# Altium schematic sheet 测量轮_Ver0.1(1).SchDoc
size 342 x 304 mm
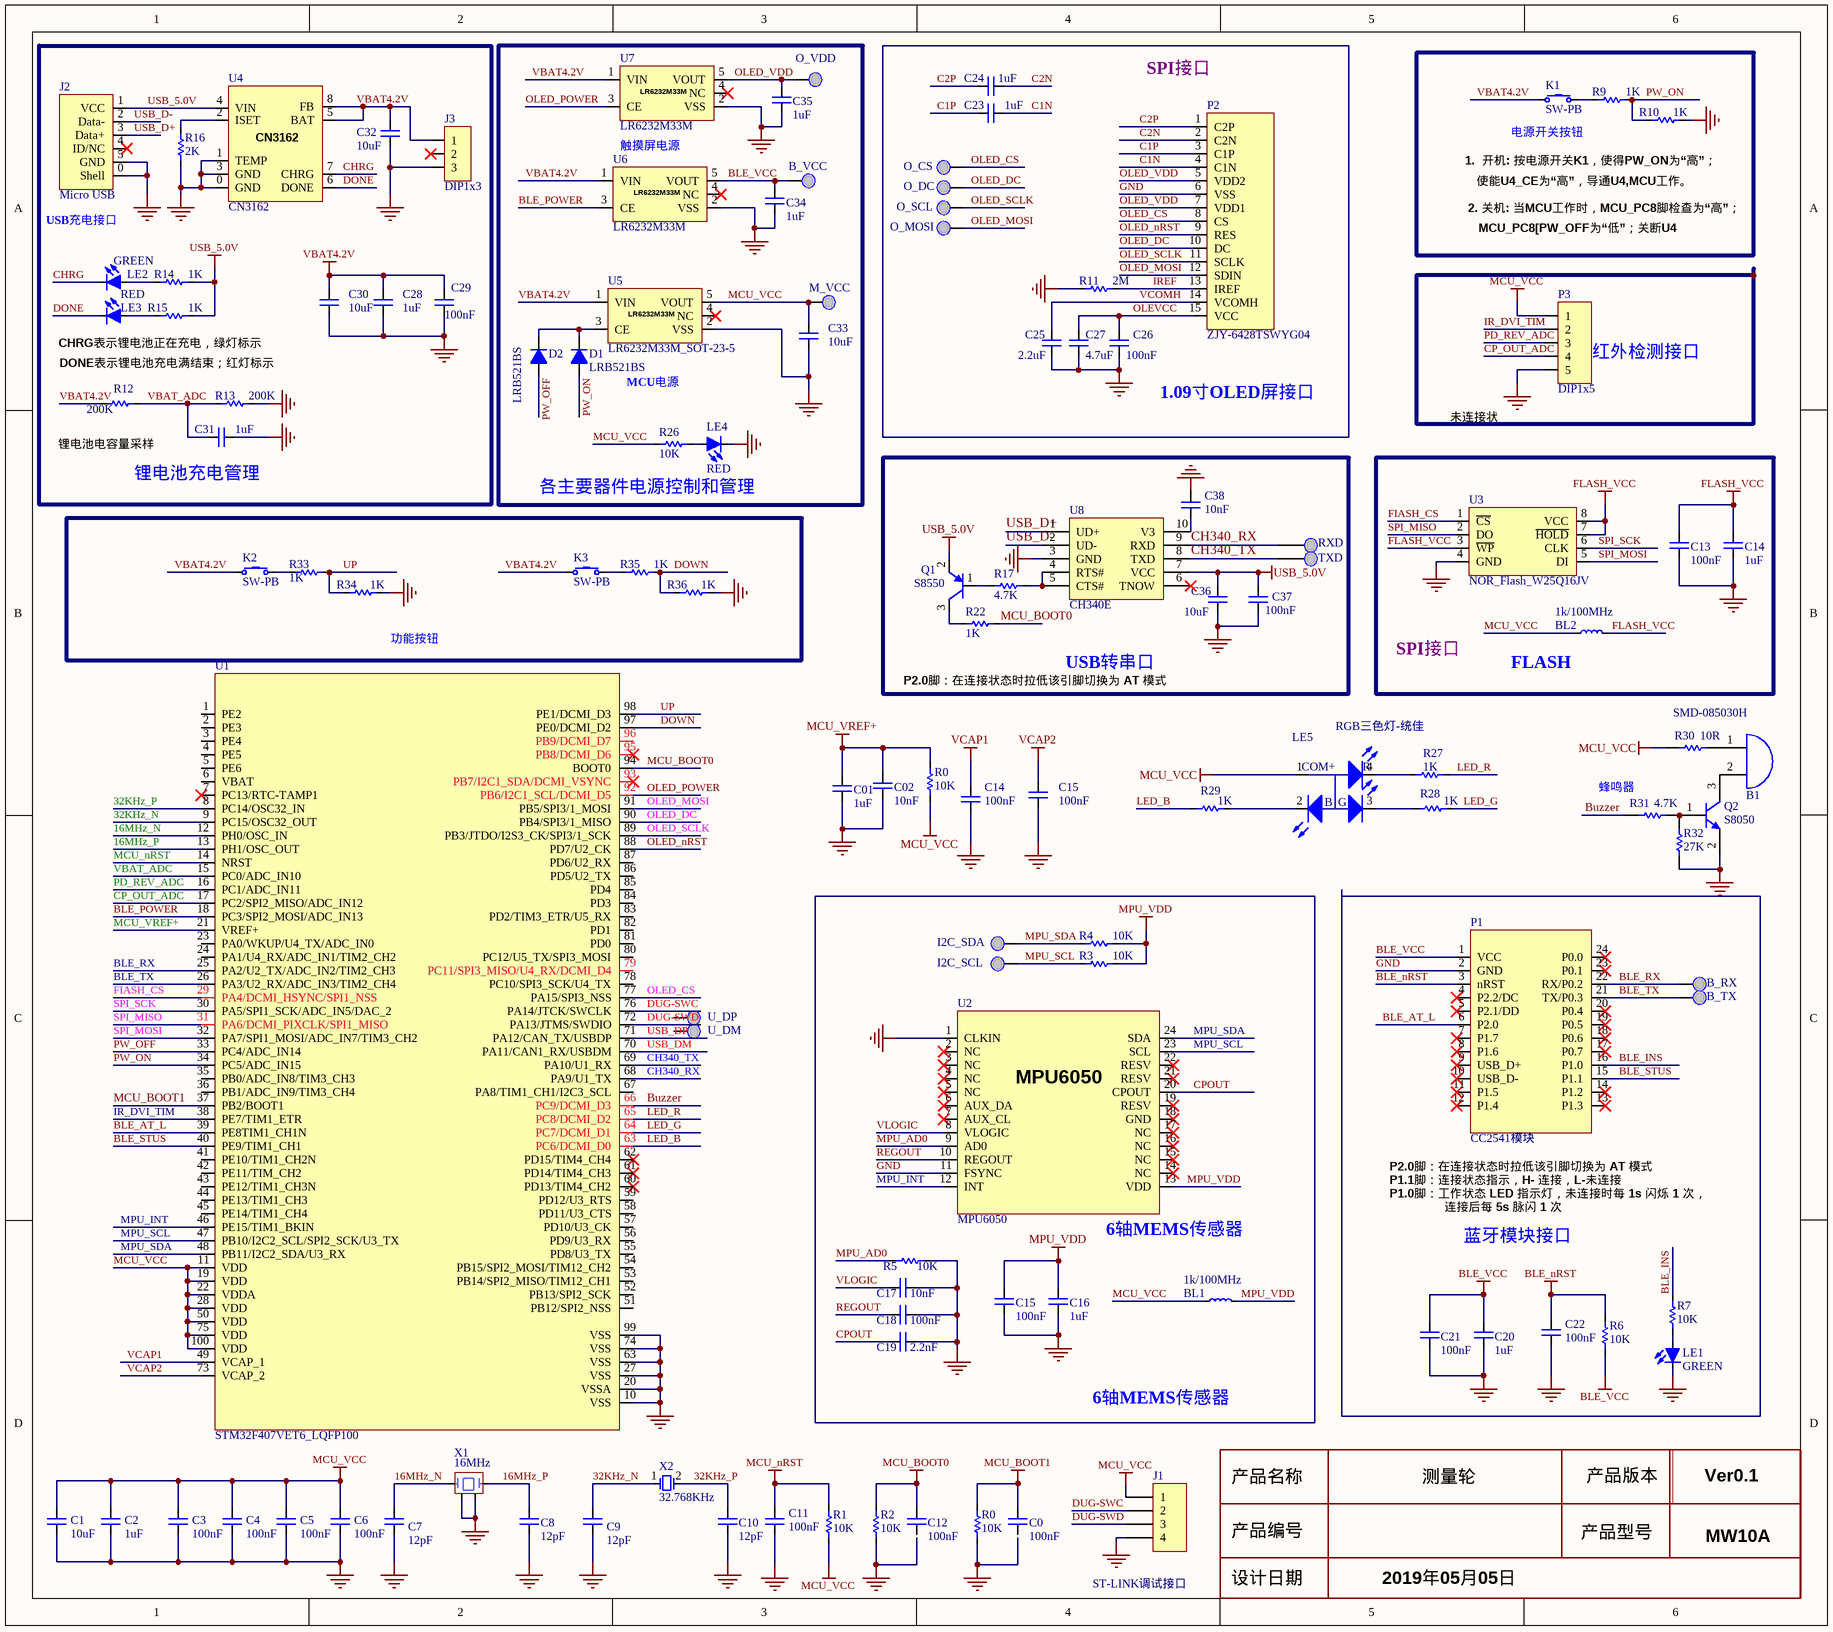
[diagram p0: 测量轮_Ver0.1(1).SchDoc]

## Parts
(Parts that share a designator on the sheet are numbered #1, #2 ... from top to bottom, then left to right.)
B1  SMD-085030H  [BEEP_1]
B_RX  TEST_Piont  [Test Piont-40]  (value not drawn)
B_TX  TEST_Piont  [Test Piont-40]  (value not drawn)
B_VCC  TEST_Piont  [Test Piont-40]  (value not drawn)
BL1  1k/100MHz  [BL0402_0.35]
BL2  1k/100MHz  [BL0402_0.35]
C0  100nF  [C0402_0.5mm]
C1  10uF  [C0603_0.8mm]
C01  1uF  [C0402_0.5mm]
C2  1uF  [C0402_0.5mm]
C02  10nF  [C0402_0.5mm]
C3  100nF  [C0402_0.5mm]
C4  100nF  [C0402_0.5mm]
C5  100nF  [C0402_0.5mm]
C6  100nF  [C0402_0.5mm]
C7  12pF  [C0402_0.5mm]
C8  12pF  [C0402_0.5mm]
C9  12pF  [C0402_0.5mm]
C10  12pF  [C0402_0.5mm]
C11  100nF  [C0402_0.5mm]
C12  100nF  [C0402_0.5mm]
C13  100nF  [C0402_0.5mm]
C14#1  1uF  [C0402_0.5mm]
C14#2  100nF  [C0402_0.5mm]
C15#1  100nF  [C0402_0.5mm]
C15#2  100nF  [C0402_0.5mm]
C16  1uF  [C0402_0.5mm]
C17  10nF  [C0402_0.5mm]
C18  100nF  [C0402_0.5mm]
C19  2.2nF  [C0402_0.5mm]
C20  1uF  [C0402_0.5mm]
C21  100nF  [C0402_0.5mm]
C22  100nF  [C0402_0.5mm]
C23  1uF  [C0402_0.5mm]
C24  1uF  [C0402_0.5mm]
C25  2.2uF  [C0402_0.5mm]
C26  100nF  [C0402_0.5mm]
C27  4.7uF  [C0402_0.5mm]
C28  1uF  [C0402_0.5mm]
C29  100nF  [C0402_0.5mm]
C30  10uF  [C0402_0.5mm]
C31  1uF  [C0402_0.5mm]
C32  10uF  [C0402_10uF]
C33  10uF  [C0402_0.5mm]
C34  1uF  [C0402_0.5mm]
C35  1uF  [C0402_0.5mm]
C36  10uF  [C0402_0.5mm]
C37  100nF  [C0402_0.5mm]
C38  10nF  [C0402_0.5mm]
D1  LRB521BS  [DFN1006-LRB521BS]
D2  LRB521BS  [DFN1006-LRB521BS]
I2C_SCL  TEST_Piont  [Test Piont-40]  (value not drawn)
I2C_SDA  TEST_Piont  [Test Piont-40]  (value not drawn)
J1  ST-LINK调试接口  [Scoket1x4_1.27mm]
J2  Micro USB
J3  DIP1x3
K1  SW-PB
K2  SW-PB
K3  SW-PB
LE1  GREEN
LE2  GREEN
LE3  RED
LE4  RED
LE5  RGB三色灯-统佳  [RGB1615-统佳]
M_VCC  TEST_Piont  [Test Piont-40]  (value not drawn)
O_CS  TEST_Piont  [Test Piont-40]  (value not drawn)
O_DC  TEST_Piont  [Test Piont-40]  (value not drawn)
O_MOSI  TEST_Piont  [Test Piont-40]  (value not drawn)
O_SCL  TEST_Piont  [Test Piont-40]  (value not drawn)
O_VDD  TEST_Piont  [Test Piont-40]  (value not drawn)
P1  CC2541模块
P2  ZJY-6428TSWYG04
P3  DIP1x5
Q1  S8550
Q2  S8050  [SOT-23]
R0#1  10K  [R0402_0.35mm]
R0#2  10K  [R0402_0.35mm]
R1  10K  [R0402_0.35mm]
R2  10K  [R0402_0.35mm]
R3  10K  [R0402_0.35mm]
R4  10K  [R0402_0.35mm]
R5  10K  [R0402_0.35mm]
R6  10K  [R0402_0.35mm]
R7  10K  [R0402_0.35mm]
R9  1K  [R0402_0.35mm]
R10  1K  [R0402_0.35mm]
R11  2M  [R0402_0.35mm]
R12  200K  [R0402_0.35mm]
R13  200K  [R0402_0.35mm]
R14  1K  [R0402_0.35mm]
R15  1K  [R0402_0.35mm]
R16  2K
R17  4.7K
R22  1K
R26  10K  [R0402_0.35mm]
R27  1K  [R0402_0.35mm]
R28  1K  [R0402_0.35mm]
R29  1K  [R0402_0.35mm]
R30  10R  [R0402_0.35mm]
R31  4.7K  [R0402_0.35mm]
R32  27K  [R0402_0.35mm]
R33  1K  [R0402_0.35mm]
R34  1K  [R0402_0.35mm]
R35  1K  [R0402_0.35mm]
R36  1K  [R0402_0.35mm]
RXD  TP  [TESTPOINT_1*1mm]  (value not drawn)
TXD  TP  [TESTPOINT_1*1mm]  (value not drawn)
U1  STM32F407VET6_LQFP100
U2  MPU6050
U3  NOR_Flash_W25Q16JV  [SOIC8-150mil_W25Q16JV]
U4  CN3162
U5  LR6232M33M_SOT-23-5  [SOT23-5_LR6232A33M]
U6  LR6232M33M
U7  LR6232M33M
U8  CH340E  [MSOP10]
U_DM  TEST_Piont  [Test Piont-40]  (value not drawn)
U_DP  TEST_Piont  [Test Piont-40]  (value not drawn)
X1  16MHz  [FA-128_16MHz_4P]
X2  32.768KHz

## Nets
BLE_nRST: C22.2 P1.3(nRST) R6.2
BLE_VCC: B_VCC.1(T) C20.2 C21.2 C34.2 P1.1(VCC) R6.1 U6.5(VOUT)
FLASH_VCC: BL2.1 C13.2 C14#1.2 U3.3(~{WP}) U3.7(~{HOLD}) U3.8(VCC)
GND: C1.1 C01.1 C2.1 C02.1 C3.1 C4.1 C5.1 C6.1 C7.1 C8.1 C9.1 C10.1 C11.1 C13.1 C14#1.1 C14#2.1 C15#1.1 C15#2.1 C16.1 C17.2 C18.2 C19.2 C20.1 C21.1 C22.1 C25.1 C26.1 C27.1 C28.2 C29.2 C30.2 C31.2 C32.1 C33.2 C34.1 C35.1 C36.1 C37.1 C38.2 J1.4 J2.0(Shell) J2.5(GND) J3.3 LE1.2(K) LE4.2(K) P1.2(GND) P2.6(VSS) P3.5 Q2.2(E) R0#2.1 R2.1 R5.2 R10.2 R11.2 R13.2 R16.1 R32.1 R34.2 R36.2 U1.10(VSS) U1.20(VSSA) U1.27(VSS) U1.63(VSS) U1.74(VSS) U1.99(VSS) U2.1(CLKIN) U2.11(FSYNC) U3.4(GND) U4.0(GND) U4.1(TEMP) U4.3(GND) U5.2(VSS) U6.2(VSS) U7.2(VSS) U8.3(GND) X1.2 X1.4
MCU_BOOT0: C12.2 R2.2 R22.2 U1.94(BOOT0)
MCU_BOOT1: C0.2 R0#2.2 U1.37(PB2/BOOT1)
MCU_nRST: C11.2 R1.2 U1.14(NRST)
MCU_VCC: BL1.2 BL2.2 C1.2 C2.2 C3.2 C4.2 C5.2 C6.2 C33.1 J1.1 LE5.1(COM) M_VCC.1(T) P3.1 R0#1.1 R1.1 R26.2 R30.2 U1.11(VDD) U1.19(VDD) U1.22(VDDA) U1.28(VDD) U1.50(VDD) U1.75(VDD) U1.100(VDD) U5.5(VOUT)
MCU_VREF+: C01.2 C02.2 R0#1.2 U1.21(VREF+)
MPU_VDD: BL1.1 C15#2.2 C16.2 R3.1 R4.1 U2.13(VDD)
USB_5.0V: C36.2 C37.2 J2.1(VCC) Q1.2(E) R14.1 R15.1 U4.4(VIN) U8.7(VCC)
VBAT4.2V: C28.1 C29.1 C30.1 C32.2 J3.1 K1.1 K2.1 K3.1 R12.1 U4.5(BAT) U4.8(FB) U5.1(VIN) U6.1(VIN) U7.1(VIN)
VCAP1: C14#2.2 U1.49(VCAP_1)
VCAP2: C15#1.2 U1.73(VCAP_2)
16MHz_N: C7.2 U1.12(PH0/OSC_IN) X1.3
16MHz_P: C8.2 U1.13(PH1/OSC_OUT) X1.1
32KHz_N: C9.2 U1.9(PC15/OSC32_OUT) X2.1
32KHz_P: C10.2 U1.8(PC14/OSC32_IN) X2.2
BLE_AT_L: P1.6(P2.0) U1.39(PE8TIM1_CH1N)
BLE_INS: P1.16(P1.0) R7.2
BLE_POWER: U1.18(PC3/SPI2_MOSI/ADC_IN13) U6.3(CE)
BLE_RX: B_RX.1(T) P1.22(RX/P0.2) U1.25(PA2/U2_TX/ADC_IN2/TIM2_CH3)
BLE_STUS: P1.15(P1.1) U1.40(PE9/TIM1_CH1)
BLE_TX: B_TX.1(T) P1.21(TX/P0.3) U1.26(PA3/U2_RX/ADC_IN3/TIM2_CH4)
Buzzer: R31.2 U1.66(PC9/DCMI_D3)
C1N: C23.1 P2.4(C1N)
C1P: C23.2 P2.3(C1P)
C2N: C24.1 P2.2(C2N)
C2P: C24.2 P2.1(C2P)
CH340_RX: RXD.1(VCC) U1.68(PA9/U1_TX) U8.9(RXD)
CH340_TX: TXD.1(VCC) U1.69(PA10/U1_RX) U8.8(TXD)
CHRG: LE2.2(K) U4.7(CHRG)
CP_OUT_ADC: P3.4 U1.17(PC2/SPI2_MISO/ADC_IN12)
CPOUT: C19.1 U2.20(CPOUT)
DONE: LE3.2(K) U4.6(DONE)
DOWN: R35.1 R36.1 U1.97(PE0/DCMI_D2)
DUG-SWC: J1.2 U1.76(PA14/JTCK/SWCLK)
DUG-SWD: J1.3 U1.72(PA13/JTMS/SWDIO)
FIASH_CS: U1.29(PA4/DCMI_HSYNC/SPI1_NSS) U3.1(~{CS})
IR_DVI_TIM: P3.2 U1.38(PE7/TIM1_ETR)
IREF: P2.13(IREF) R11.1
LED_B: R29.2 U1.63(PC6/DCMI_D0)
LED_G: R28.1 U1.64(PC7/DCMI_D1)
LED_R: R27.1 U1.65(PC8/DCMI_D2)
MPU_AD0: R5.1 U2.9(AD0)
MPU_INT: U1.46(PE15/TIM1_BKIN) U2.12(INT)
MPU_SCL: I2C_SCL.1(T) R3.2 U1.47(PB10/I2C2_SCL/SPI2_SCK/U3_TX) U2.23(SCL)
MPU_SDA: I2C_SDA.1(T) R4.2 U1.48(PB11/I2C2_SDA/U3_RX) U2.24(SDA)
OLED_CS: O_CS.1(T) P2.8(CS) U1.77(PA15/SPI3_NSS)
OLED_DC: O_DC.1(T) P2.10(DC) U1.90(PB4/SPI3/1_MISO)
OLED_MOSI: O_MOSI.1(T) P2.12(SDIN) U1.91(PB5/SPI3/1_MOSI)
OLED_nRST: P2.9(RES) U1.88(PD7/U2_CK)
OLED_POWER: U1.92(PB6/I2C1_SCL/DCMI_D5) U7.3(CE)
OLED_SCLK: O_SCL.1(T) P2.11(SCLK) U1.89(PB3/JTDO/I2S3_CK/SPI3/1_SCK)
OLED_VDD: C35.2 O_VDD.1(T) P2.5(VDD2) P2.7(VDD1) U7.5(VOUT)
OLEVCC: C26.2 C27.2 P2.15(VCC)
PD_REV_ADC: P3.3 U1.16(PC1/ADC_IN11)
PW_OFF: D2.2 U1.33(PC4/ADC_IN14)
PW_ON: D1.2 R9.1 R10.1 U1.34(PC5/ADC_IN15)
REGOUT: C18.1 U2.10(REGOUT)
SPI_MISO: U1.31(PA6/DCMI_PIXCLK/SPI1_MISO) U3.2(DO)
SPI_MOSI: U1.32(PA7/SPI1_MOSI/ADC_IN7/TIM3_CH2) U3.5(DI)
SPI_SCK: U1.30(PA5/SPI1_SCK/ADC_IN5/DAC_2) U3.6(CLK)
UP: R33.1 R34.1 U1.98(PE1/DCMI_D3)
USB_D+: J2.3(Data+) U8.1(UD+)
USB_D-: J2.2(Data-) U8.2(UD-)
USB_DM: U1.70(PA11/CAN1_RX/USBDM)
USB_DP: U1.71(PA12/CAN_TX/USBDP)
VBAT_ADC: C31.1 R12.2 R13.1 U1.15(PC0/ADC_IN10)
VCOMH: C25.2 P2.14(VCOMH)
VLOGIC: C17.1 U2.8(VLOGIC)
NetB1_1: B1.1 R30.1
NetB1_2: B1.2 Q2.3(C)
NetC38_1: C38.1 U8.10(V3)
NetD1_1: D1.1 D2.1 U5.3(CE)
NetK1_2: K1.2 R9.2
NetK2_2: K2.2 R33.2
NetK3_2: K3.2 R35.2
NetLE1_1: LE1.1(A) R7.1
NetLE2_1: LE2.1(A) R14.2
NetLE3_1: LE3.1(A) R15.2
NetLE4_1: LE4.1(A) R26.1
NetLE5_2: LE5.2(B) R29.1
NetLE5_3: LE5.3(G) R28.2
NetLE5_4: LE5.4(R) R27.2
NetQ1_1: Q1.1(B) R17.2
NetQ1_3: Q1.3(C) R22.1
NetQ2_1: Q2.1(B) R31.1 R32.2
NetR16_2: R16.2 U4.2(ISET)
NetR17_1: R17.1 U8.4(RTS#) U8.5(CTS#)

Not connected (* = marked no-connect by the designer): C0 1; C12 1; J2 4(ID/NC)*; J3 2*; P1 4(P2.2/DC)* 5(P2.1/DD)* 7(P1.7)* 8(P1.6)* 9(USB_D+)* 10(USB_D-)* 11(P1.5)* 12(P1.4)* 13(P1.3)* 14(P1.2)* 17(P0.7)* 18(P0.6)* 19(P0.5)* 20(P0.4)* 23(P0.1)* 24(P0.0)*; U1 1(PE2) 2(PE3) 3(PE4) 4(PE5) 5(PE6) 6(VBAT) 7(PC13/RTC-TAMP1)* 23(PA0/WKUP/U4_TX/ADC_IN0) 24(PA1/U4_RX/ADC_IN1/TIM2_CH2) 35(PB0/ADC_IN8/TIM3_CH3) 36(PB1/ADC_IN9/TIM3_CH4) 41(PE10/TIM1_CH2N) 42(PE11/TIM_CH2) 43(PE12/TIM1_CH3N) 44(PE13/TIM1_CH3) 45(PE14/TIM1_CH4) 51(PB12/SPI2_NSS) 52(PB13/SPI2_SCK) 53(PB14/SPI2_MISO/TIM12_CH1) 54(PB15/SPI2_MOSI/TIM12_CH2) 55(PD8/U3_TX) 56(PD9/U3_RX) 57(PD10/U3_CK) 58(PD11/U3_CTS) 59(PD12/U3_RTS) 60(PD13/TIM4_CH2)* 61(PD14/TIM4_CH3)* 62(PD15/TIM4_CH4)* 67(PA8/TIM1_CH1/I2C3_SCL) 78(PC10/SPI3_SCK/U4_TX) 79(PC11/SPI3_MISO/U4_RX/DCMI_D4) 80(PC12/U5_TX/SPI3_MOSI) 81(PD0) 82(PD1) 83(PD2/TIM3_ETR/U5_RX) 84(PD3) 85(PD4) 86(PD5/U2_TX) 87(PD6/U2_RX) 93(PB7/I2C1_SDA/DCMI_VSYNC)* 95(PB8/DCMI_D6)* 96(PB9/DCMI_D7); U2 2(NC)* 3(NC)* 4(NC)* 5(NC)* 6(AUX_DA)* 7(AUX_CL)* 14(NC)* 15(NC)* 16(NC)* 17(NC)* 18(GND)* 19(RESV)* 21(RESV)* 22(RESV)*; U5 4(NC)*; U6 4(NC)*; U7 4(NC)*; U8 6(TNOW)*; U_DM 1(T); U_DP 1(T)

## Notes on the sheet
- (near P2) SPI接口
- 触摸屏电源
- (near K1) 电源开关按钮
- 1.  开机: 按电源开关K1，使得PW_ON为“高”；
- USB充电接口
- MCU_PC8[PW_OFF为“低”；关断U4
- 使能U4_CE为“高”，导通U4,MCU工作。
- 2. 关机: 当MCU工作时，MCU_PC8脚检查为“高”；
- CHRG表示锂电池正在充电，绿灯标示
- DONE表示锂电池充电满结束；红灯标示
- (near P3) 红外检测接口
- (near R12) 锂电池电容量采样
- MCU电源
- 1.09寸OLED屏接口
- 未连接状
- (near C31) 锂电池充电管理
- (near R26) 各主要器件电源控制和管理
- 功能按钮
- P2.0脚：在连接状态时拉低该引脚切换为 AT 模式
- USB转串口
- SPI接口
- (near BL2) FLASH
- (near R31) 蜂鸣器
- P1.1脚：连接状态指示，H- 连接，L-未连接
- (near U2) 6轴MEMS传感器
- P1.0脚：工作状态 LED 指示灯，未连接时每 1s 闪烁 1 次，
- 蓝牙模块接口
- 连接后每 5s 脉闪 1 次
- 6轴MEMS传感器
- 产品名称
- 测量轮
- 产品版本
- Ver0.1
- 产品编号
- 设计日期
- 2019年05月05日
- 产品型号
- MW10A
- (in symbol LR6232M33M_SOT-23-5) LR6232M33M
- (in symbol RGB三色灯-统佳) COM+

## Library data of the parts
B1 = BEEP: 蜂鸣器
BL1 BL2 = IND
C0 C1 C01 C2 C02-C13 C14#1 C14#2 C15#1 C15#2 C16-C38 = CAP_NPOL
D1 D2 = DIO: switch.1N4148: SODFL160X70-2N; rectifier.SBR0240LP: DFN1006-2
J1 = header4
J2 = Micro USB: 羊角头Micro USB 母座 定型
K1-K3 = SW-PB: 轻触开关
LE1-LE4 = LED-GREEN
P1 = CC2541模块: CC2541外置模块
P2 = ZJY-6428TSWYG04: 中景园 1.09寸OLED屏
Q1 = S8550: PNP三极管
Q2 = NPN1: 贴片三极管
R0#1 R0#2 R1-R7 R11 R26-R29 = RSE
R9 R10 R12-R17 R22 R33-R36 = RSE: 贴片电阻
R30-R32 = RES1: 贴片电阻
RXD TXD = TP: TEST POINT
U2 = MPU6050: 6轴加速度和陀螺仪
U4 = CN3162: 锂电池充电管理IC
U6 U7 = LR6232M33M_SOT-23-5
U8 = CH340E: USB转串口芯片
X1 = FA-128_16MHz
X2 = XTAL: 晶体振荡器